# EAGLE design tag (EAGLE 6.4)
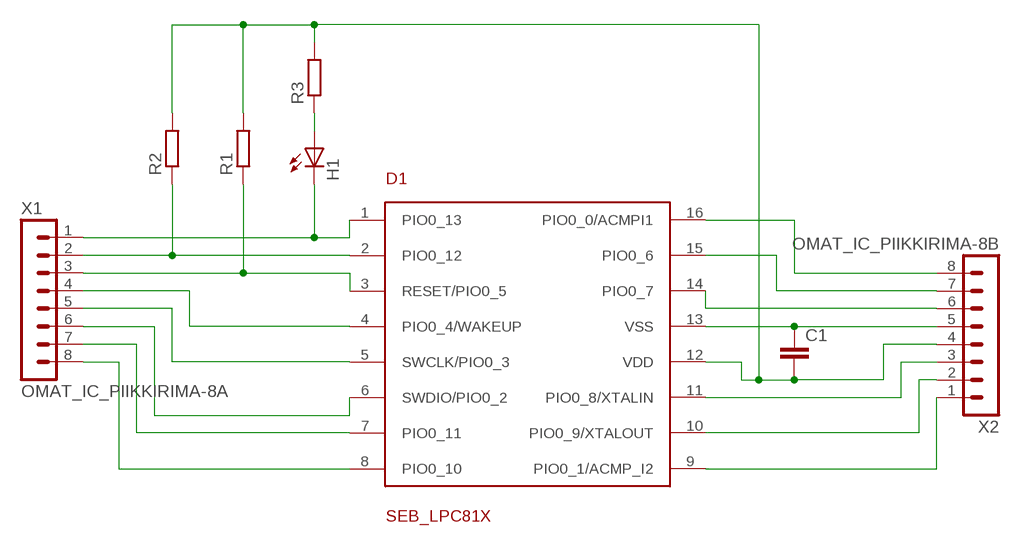
[diagram p0: schematic, sheet 1]

## Parts
C1  RCL_C-EUC0603  [RCL_C0603]
D1  SEB_LPC81X  [SEB_TSSOP16]
H1  OMAT_IC_LEDCHIP-LED0603  [OMAT_IC_CHIP-LED0603]
R1  RCL_R-EU_R0603  [RCL_R0603]
R2  RCL_R-EU_R0603  [RCL_R0603]
R3  RCL_R-EU_R0603  [RCL_R0603]
X1  OMAT_IC_PIIKKIRIMA-8A  [OMAT_IC_PIIKKIRIMA-8]
X2  OMAT_IC_PIIKKIRIMA-8B  [OMAT_IC_PIIKKIRIMA-8_2]

## Nets
+3V3: C1.2 D1.12(VDD) R1.2 R2.2 R3.2 X2.4
GND: C1.1 D1.13(VSS) X2.5
N$1: D1.8(PIO0_10) X1.8
N$2: D1.7(PIO0_11) X1.7
N$3: D1.6(SWDIO/PIO0_2) X1.6
N$4: D1.5(SWCLK/PIO0_3) X1.5
N$5: D1.4(PIO0_4/WAKEUP) X1.4
N$6: D1.3(RESET/PIO0_5) R1.1 X1.3
N$7: D1.2(PIO0_12) R2.1 X1.2
N$8: D1.1(PIO0_13) H1.C X1.1
N$11: H1.A R3.1
N$12: D1.9(PIO0_1/ACMP_I2) X2.1
N$13: D1.10(PIO0_9/XTALOUT) X2.2
N$14: D1.11(PIO0_8/XTALIN) X2.3
N$18: D1.14(PIO0_7) X2.6
N$19: D1.15(PIO0_6) X2.7
N$20: D1.16(PIO0_0/ACMPI1) X2.8

## Library data of the parts
C1 = oled-lpc81x:RCL_C-EU: CAPACITOR, European symbol
D1 = oled-lpc81x:SEB_LPC81X
H1 = oled-lpc81x:OMAT_IC_LED: LED OSRAM: - CHIPLED LG R971, LG N971, LY N971, LG Q971, LY Q971, LO R971, LY R971 LH N974, LH R974 LS Q976, LO Q976, LY Q976 LO Q996 - Hyper CHIPLED LW Q18S LB Q993, LB Q99A, LB R99A - SideLED LS A670, LO A670, LY A670, LG A670, LP A670 LB A673, LV A673, LT A673, LW A673 LH A674 LY A675 LS A676, LA A676, LO A676, LY A676, LW A676 LS A679, LY A679, LG A679 - Hyper Micro SIDELED® LS Y876, LA Y876, LO Y876, LY Y876 LT Y87S - SmartLED LW L88C, LW L88S LB L89C, LB L89S, LG L890 LS L89K, LO L89K, LY L89K LS L896, LA L896, LO L896, LY L896 - TOPLED LS T670, LO T670, LY T670, LG T670, LP T670 LSG T670, LSP T670, LSY T670, LOP T670, LYG T670 LG T671, LOG T671, LSG T671 LB T673, LV T673, LT T673, LW T673 LH T674 LS T676, LA T676, LO T676, LY T676, LB T676, LH T676, LSB T676, LW T676 LB T67C, LV T67C, LT T67C, LS T67K, LO T67K, LY T67K, LW E67C LS E67B, LA E67B, LO E67B, LY E67B, LB E67C, LV E67C, LT E67C LW T67C LS T679, LY T679, LG T679 LS T770, LO T770, LY T770, LG T770, LP T770 LB T773, LV T773, LT T773, LW T773 LH T774 LS E675, LA E675, LY E675, LS T675 LS T776, LA T776, LO T776, LY T776, LB T776 LHGB T686 LT T68C, LB T68C - Hyper Mini TOPLED® LB M676 - Mini TOPLED Santana® LG M470 LS M47K, LO M47K, LY M47K Source: http://www.osram.convergy.de LUXEON: - LUMILED® LXK2-PW12-R00, LXK2-PW12-S00, LXK2-PW14-U00, LXK2-PW14-V00 LXK2-PM12-R00, LXK2-PM12-S00, LXK2-PM14-U00 LXK2-PE12-Q00, LXK2-PE12-R00, LXK2-PE12-S00, LXK2-PE14-T00, LXK2-PE14-U00 LXK2-PB12-K00, LXK2-PB12-L00, LXK2-PB12-M00, LXK2-PB14-N00, LXK2-PB14-P00, LXK2-PB14-Q00 LXK2-PR12-L00, LXK2-PR12-M00, LXK2-PR14-Q00, LXK2-PR14-R00 LXK2-PD12-Q00, LXK2-PD12-R00, LXK2-PD12-S00 LXK2-PH12-R00, LXK2-PH12-S00 LXK2-PL12-P00, LXK2-PL12-Q00, LXK2-PL12-R00 Source: www.luxeon.com KINGBRIGHT: KA-3528ASYC Source: www.kingbright.com
R1-R3 = oled-lpc81x:RCL_R-EU_: RESISTOR, European symbol
X1 X2 = oled-lpc81x:OMAT_IC_PIIKKIRIMA-8

## Board
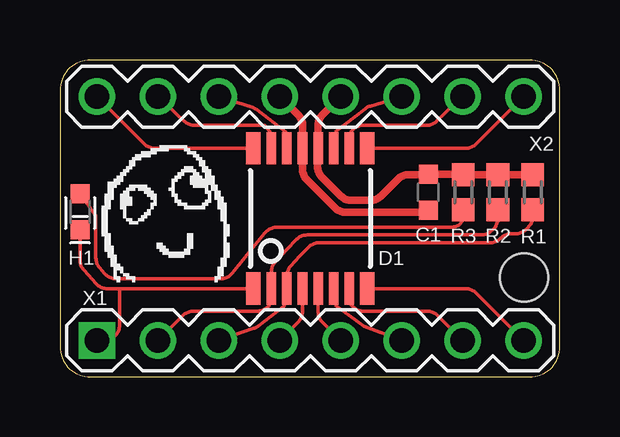
[diagram p1: board, top side]
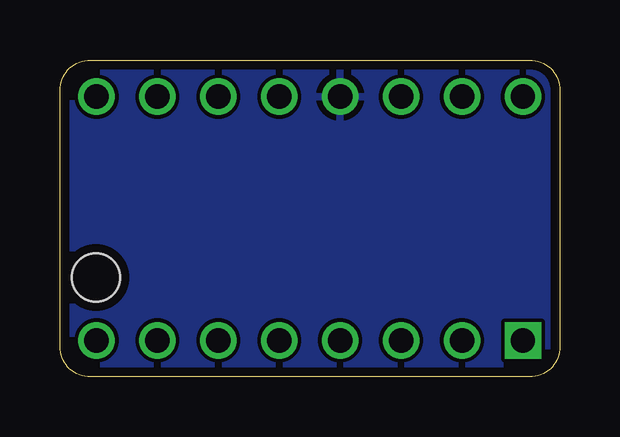
[diagram p2: board, bottom side, seen from below]

Size 20.85 x 13.21 mm. Coordinates in mm from the lower left corner, seen from the top.
Outline: 1.27,0 19.58,0 arc90 20.85,1.27 20.85,11.94 arc90 19.58,13.21 1.27,13.21 arc90 0,11.94 0,1.27 arc90 1.27,0
Copper layers (1*16): Top 0.0356mm / dielectric 1.5011mm / Bottom 0.0356mm
Design rules "LaenPCBOrder": minimum track width 6mil, minimum drill 13mil, track to track 6mil, track to pad 6mil, pad to pad 6mil, via to via 6mil, smd to smd 6mil, copper to edge 15mil, drill to drill 6mil, minimum pad ring 7mil, minimum via ring 7mil, stop-mask expansion 4mil, vias tented up to drill 0mil, thermal gap 10mil
Holes 2 mm at 19.35,4.14

### Footprints (pad centres in the part's own frame; a part is rotated, then mirrored left to right if it is on the bottom)
RCL_C0603 = smd 0.8 x 0.8: 1 -0.75,0; 2 0.75,0
SEB_TSSOP16 = smd 0.6 x 1.35: 1 -2.375,-2.925; 8 2.375,-2.925; 9 2.375,2.925; 16 -2.375,2.925 | smd 0.4 x 1.35: 2 -1.625,-2.925; 3 -0.975,-2.925; 4 -0.325,-2.925; 5 0.325,-2.925; 6 0.975,-2.925; 7 1.625,-2.925; 10 1.625,2.925; 11 0.975,2.925; 12 0.325,2.925; 13 -0.325,2.925; 14 -0.975,2.925; 15 -1.625,2.925
OMAT_IC_CHIP-LED0603 = smd 0.8 x 0.8: A -0.75,0; C 0.75,0
RCL_R0603 = smd 0.95 x 0.95: 1 -0.725,0; 2 0.725,0
OMAT_IC_PIIKKIRIMA-8 = drill 1.016 square: 1 0,0 | drill 1.016: 2 2.54,0; 3 5.08,0; 4 7.62,0; 5 10.16,0; 6 12.7,0; 7 15.24,0; 8 17.78,0
OMAT_IC_PIIKKIRIMA-8_2 = drill 1.016: 1 0,0; 2 2.54,0; 3 5.08,0; 4 7.62,0; 5 10.16,0; 6 12.7,0; 7 15.24,0; 8 17.78,0

### Placement (x,y rotation side)
C1  15.37,7.7 90 top
D1  10.44,6.6 0 top
H1  0.84,6.88 270 top
R1  19.71,7.7 90 top
R2  18.26,7.7 90 top
R3  16.81,7.7 90 top
U$1  [DAFUG]  4.6,6.55 0 top
X1  1.55,1.52 0 top
X2  19.33,11.68 180 top

### Tracks (layer width: path | path; a pad name or v marks a point on that pad's centre or on a via)
+3V3
  Top 0.305: R1.2 R2.2 R3.2 16.82,8.45 C1.2 15.35,8.43 14.54,8.43 arc45 14.09,8.25 13.38,7.54 arc-45 12.93,7.35 12.16,7.35 arc-45 11.71,7.54 10.93,8.32 arc-45 10.74,8.77 10.74,9.51 D1.12 10.76,10.48 arc-45 10.95,10.93 X2.4
GND
  Top 0.305: X2.5 9.93,10.93 arc-45 10.11,10.48 D1.13 10.11,8.67 arc45 10.29,8.22 11.47,7.04 arc45 11.92,6.86 15.28,6.86 C1.1
  pour Bottom: 0,0 20.83,0 20.83,13.21 0,13.21
N$1
  Top 0.152: D1.8 16.91,3.68 arc-45 17.36,3.49 X1.8
N$2
  Top 0.152: D1.7 12.06,3.07 12.21,2.93 arc45 12.66,2.74 15.31,2.74 arc-45 15.76,2.56 X1.7
N$3
  Top 0.152: D1.6 11.51,2.97 12.68,2.11 X1.6
N$4
  Top 0.152: D1.5 10.77,2.71 arc46 10.96,2.25 X1.5
N$5
  Top 0.152: D1.4 10.11,2.73 arc-45 9.92,2.28 X1.4
N$6
  Top 0.152: X1.3 8.08,2.02 arc18 8.26,2.12 9.35,2.95 D1.3 9.46,4.2 arc-40 9.62,4.61 9.99,5.03 10.41,5.45 arc-45 10.86,5.59 17.92,5.59 arc45 18.37,5.77 18.38,5.78 arc-45 18.83,5.97 18.99,5.97 arc45 19.44,6.16 19.52,6.24 arc45 19.71,6.69 R1.1 19.76,6.92
N$7
  Top 0.152: X1.2 5.12,2.56 arc-45 5.57,2.74 8.22,2.74 arc45 8.67,2.93 8.71,2.97 D1.2 8.81,4.38 arc-43 8.98,4.8 9.46,5.33 9.86,5.73 arc-45 10.31,5.92 17.57,5.92 arc45 18.02,6.1 18.08,6.16 arc45 18.26,6.61 R2.1
N$8
  Top 0.152: D1.1 2.49,3.68 | 2.49,3.68 1.99,3.68 arc-47 1.52,3.88 1.01,4.44 arc-43 0.84,4.87 H1.C | X1.1 1.85,1.52 arc90 2.49,2.16 2.49,3.68
N$11
  Top 0.152: H1.A 1.45,6.79 arc-36 1.5,6.64 1.5,4.96 arc41 1.66,4.54 1.87,4.3 arc49 2.34,4.09 6.69,4.09 arc53 7.2,4.34 8.17,5.54 8.54,5.99 arc-45 9.01,6.25 16.22,6.25 arc45 16.67,6.36 arc45 16.82,6.71 R3.1
N$12
  Top 0.152: D1.9 16.91,9.53 arc45 17.36,9.71 X2.1
N$13
  Top 0.152: D1.10 12.06,10.13 12.18,10.27 arc-49 12.66,10.49 15.29,10.49 arc44 15.73,10.67 X2.2
N$14
  Top 0.152: D1.11 11.51,10.24 12.73,11.18 arc-21 12.94,11.29 X2.3
N$18
  Top 0.152: D1.14 9.4,10.21 8.22,11.13 arc20 8.02,11.24 X2.6
N$19
  Top 0.152: D1.15 8.81,10.13 8.53,10.49 5.61,10.49 arc-43 5.18,10.66 X2.7
N$20
  Top 0.152: D1.16 3.97,9.53 arc-45 3.52,9.71 X2.8

### Text on the board
bStop: LPC81X MINIMAL / 27.09.2013 KL